# EAGLE design ElectronicThermometerCPO_v7 (EAGLE 9.5.2)
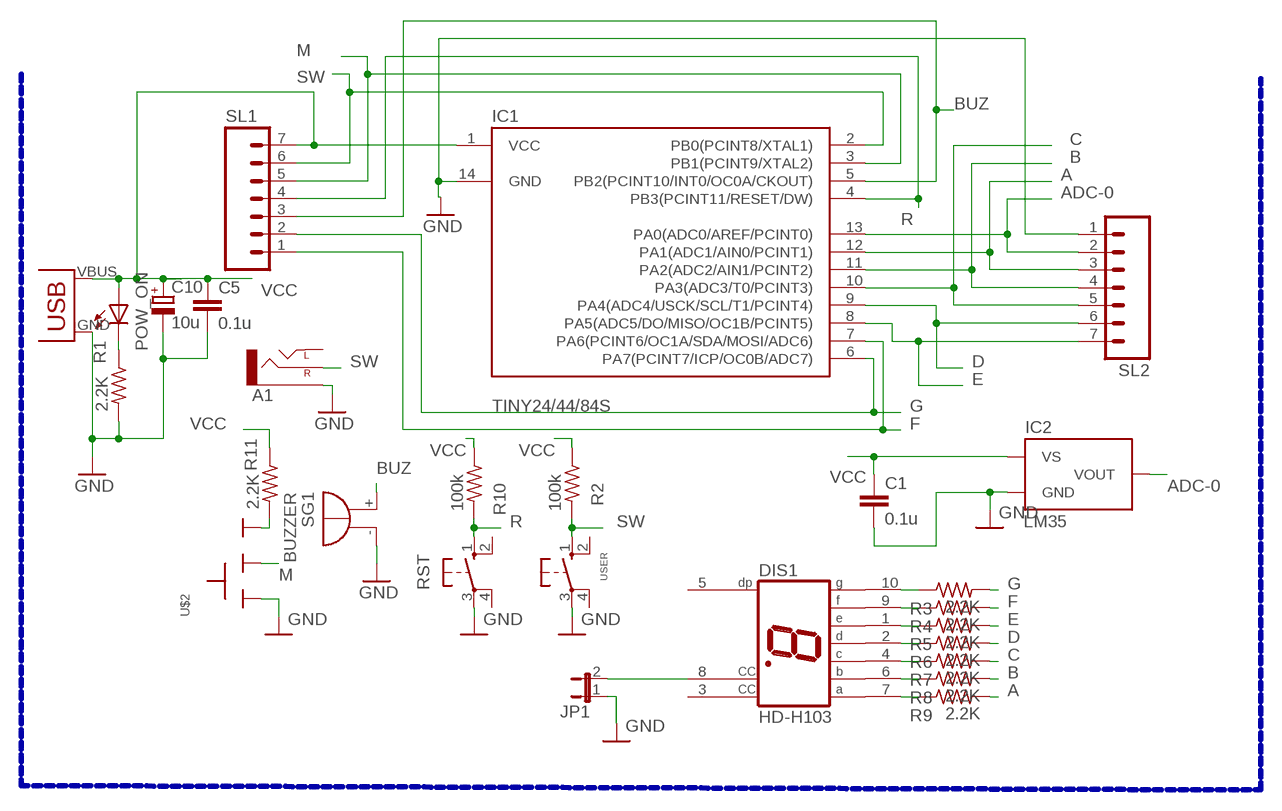
[diagram p0: schematic, sheet 1]

## Parts
A1  AUDIO-JACKPTH  [AUDIO-JACK]
C1  0.1u  C-EUC0805  [C0805]
C5  0.1u  C-EUC0805  [C0805]
C10  10u  CPOL-EUB/3528-21R  [B/3528-21R]
DIS1  HD-H103  [HDSP-M]
IC1  TINY24/44/84S  [SOIC14]
IC2  LM35  [TO92]
JP1  JP1E  [JP1]
POW_ON  LED3MM  [LED3MM]
R1  2.2K  R-US_0207/10  [0207/10]
R2  100k  R-US_0207/10  [0207/10]
R3  2.2K  R-US_0207/10  [0207/10]
R4  2.2K  R-US_0207/10  [0207/10]
R5  2.2K  R-US_0207/10  [0207/10]
R6  2.2K  R-US_0207/10  [0207/10]
R7  2.2K  R-US_0207/10  [0207/10]
R8  2.2K  R-US_0207/10  [0207/10]
R9  2.2K  R-US_0207/10  [0207/10]
R10  100k  R-US_0207/10  [0207/10]
R11  2.2K  R-US_0207/10  [0207/10]
RST  10-XX  [B3F-10XX]
SG1  BUZZER  [F/TMB]
SL1  M07  [07P]
SL2  M07  [07P]
U$1  USB(POWER)  [USB(POWER)]
U$2  SLIDESWITCH-BIG  [BIGSWITCH]
USER  40-XX  [B3F-40XX]

## Nets
A: IC1.12(PA1(ADC1/AIN0/PCINT1)) R9.2 SL2.3
ADC-0: IC1.13(PA0(ADC0/AREF/PCINT0)) IC2.VOUT SL2.2
B: IC1.11(PA2(ADC2/AIN1/PCINT2)) R8.2 SL2.4
BUZ: IC1.5(PB2(PCINT10/INT0/OC0A/CKOUT)) SG1.+ SL1.3
C: IC1.10(PA3(ADC3/T0/PCINT3)) R7.2 SL2.5
D: IC1.9(PA4(ADC4/USCK/SCL/T1/PCINT4)) R6.2 SL2.6
E: IC1.8(PA5(ADC5/DO/MISO/OC1B/PCINT5)) R5.2 SL2.7
F: IC1.7(PA6(PCINT6/OC1A/SDA/MOSI/ADC6)) R4.2 SL1.1
G: IC1.6(PA7(PCINT7/ICP/OC0B/ADC7)) R3.2 SL1.2
GND: A1.SLEEVE C1.2 C5.2 C10.- IC1.14(GND) IC2.GND JP1.1 R1.2 RST.3(P) SG1.- SL2.1 U$1.GND U$2.1 USER.3(P)
M: IC1.3(PB1(PCINT9/XTAL2)) SL1.5 U$2.2
N$1: POW_ON.K(C) R1.1
N$2: DIS1.8(CC) JP1.2
N$6: DIS1.10(G) R3.1
N$7: DIS1.9(F) R4.1
N$9: R11.2 U$2.3
N$10: DIS1.1(E) R5.1
N$11: DIS1.2(D) R6.1
N$12: DIS1.4(C) R7.1
N$13: DIS1.6(B) R8.1
N$20: DIS1.7(A) R9.1
R: IC1.4(PB3(PCINT11/RESET/DW)) R10.2 RST.1(S) SL1.4
SW: A1.RING(RIGHT) IC1.2(PB0(PCINT8/XTAL1)) R2.2 SL1.6 USER.1(S)
VCC: C1.1 C5.1 C10.+ IC1.1(VCC) IC2.VS POW_ON.A R2.1 R10.1 R11.1 SL1.7 U$1.VBUS(VCC)
Unconnected: A1.TIP(LEFT) DIS1.3(CC) DIS1.5(DP) RST.2(S1) RST.4(P1) USER.2(S1) USER.4(P1)

## Buses
B$1

## Library data of the parts
A1 = CEDT_JANUARY_2015_v5:AUDIO-JACK: 3.5mm Audio Jack Simple 3.5mm common PCB mount audio jack. SKU: PRT-08032
C1 C5 = rcl:C-EU: CAPACITOR, European symbol
C10 = rcl:CPOL-EU: POLARIZED CAPACITOR, European symbol
DIS1 = display-hp:HD-H103: LED DISPLAY 1-character 7 segment, decimal point right; OC_FARNELL: unknown; OC_NEWARK: unknown
IC1 = CEDT_JANUARY_2015_v5:TINY24/44/84S
IC2 = CEDT_JANUARY_2015_v5:LM35
JP1 = jumper:JP1E: JUMPER
POW_ON = CEDT_SEPTEMBER_V2:LED
R1-R11 = rcl:R-US_: RESISTOR, American symbol
RST = switch-omron:10-XX: OMRON SWITCH; MPN: B3F-1000; OC_FARNELL: 176432; OC_NEWARK: 36M3542
SG1 = CEDT_JANUARY_2015_v5:BUZZER: BUZZER Source: Buerklin; OC_FARNELL: unknown; OC_NEWARK: unknown
SL1 SL2 = con-amp-quick:M07: AMP QUICK CONNECTOR; OC_FARNELL: unknown; OC_NEWARK: unknown
U$1 = CEDT_JANUARY_2015_v5:USB(POWER)
U$2 = CEDT_JANUARY_2015_v5:SLIDESWITCH
USER = switch-omron:40-XX: OMRON SWITCH; MF: OMRON COMPONENTS USA; MPN: B3F-4000; OC_FARNELL: 176434; OC_NEWARK: 36K3105

## Board
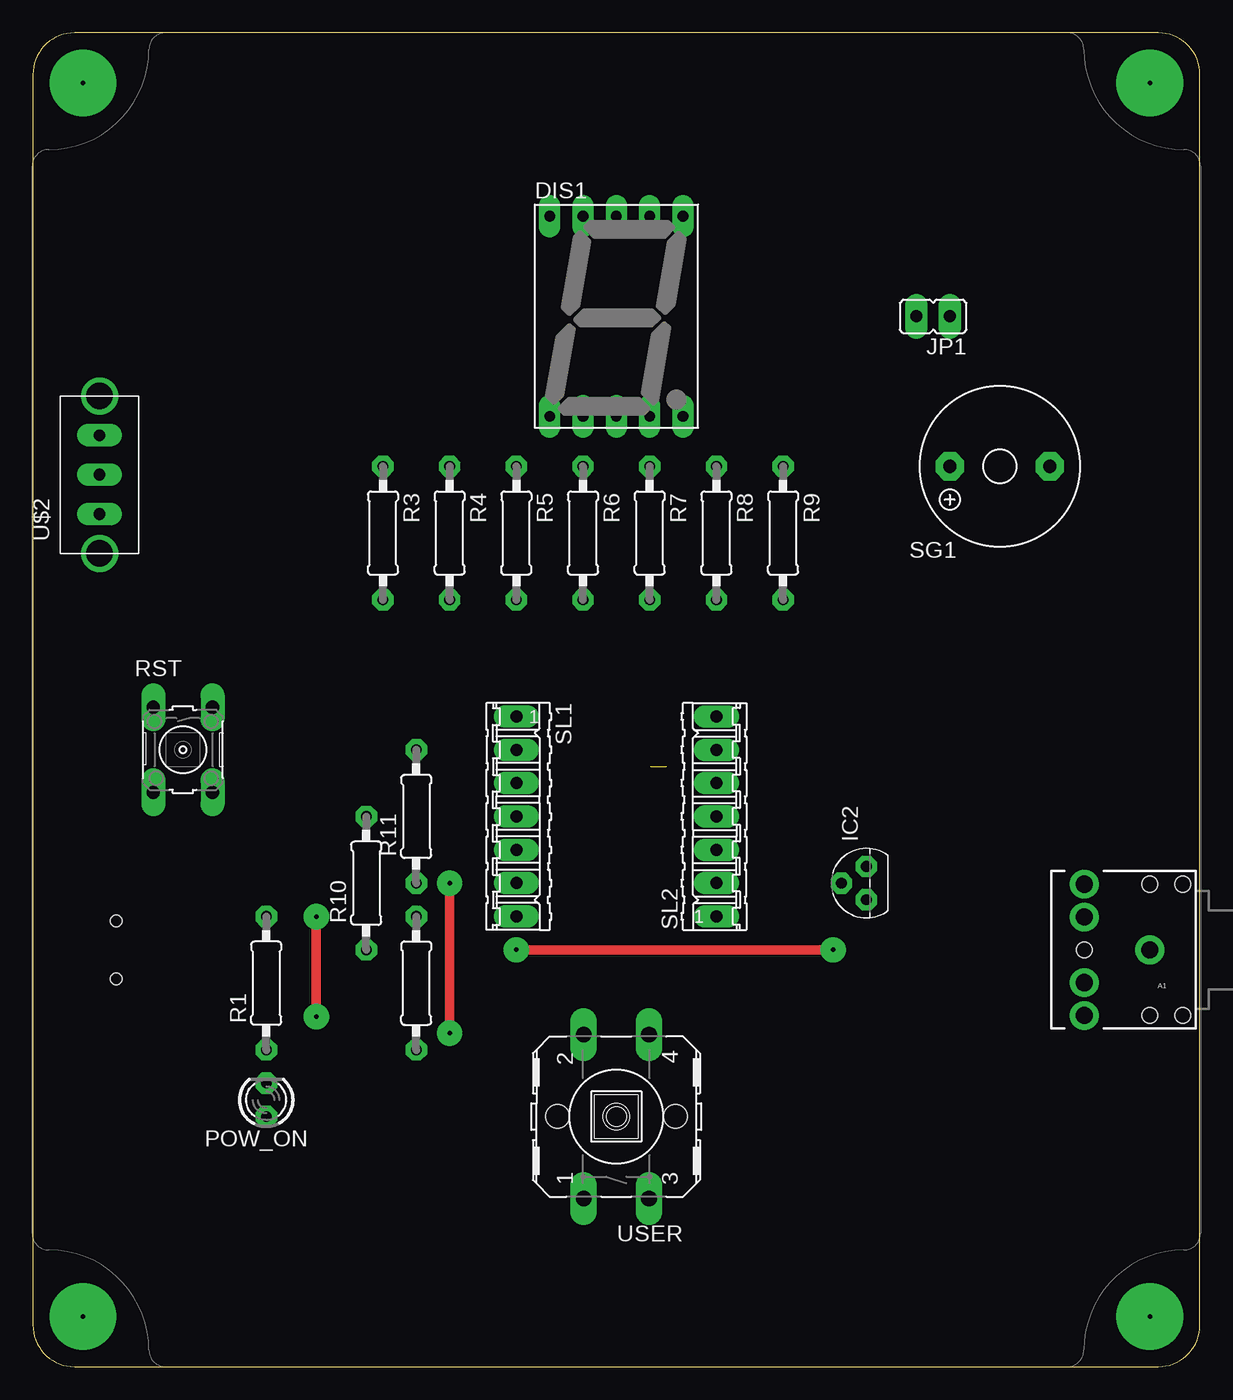
[diagram p1: board, top side]
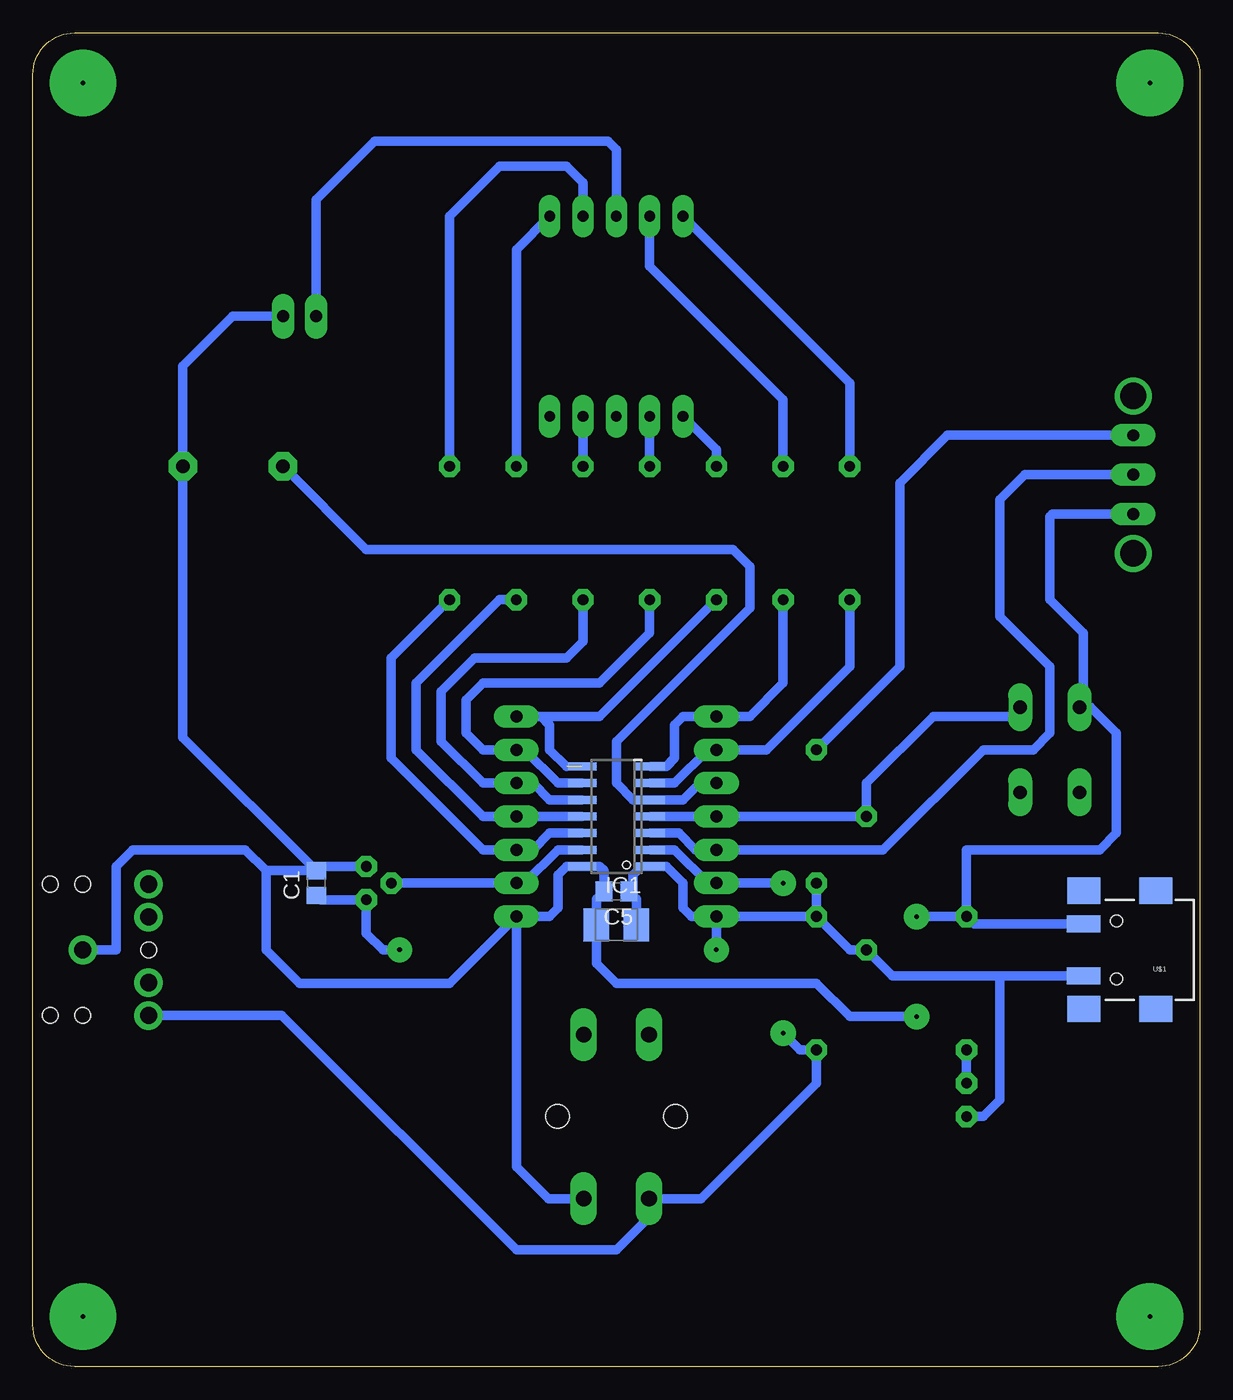
[diagram p2: board, bottom side, seen from below]

Size 88.9 x 101.6 mm. Coordinates in mm from the lower left corner, seen from the top.
Outline: 0,3.17 arc90 3.17,0 85.72,0 arc90 88.9,3.17 88.9,98.42 arc90 85.72,101.6 3.17,101.6 arc90 0,98.42 0,3.17
Copper layers (1*16): Top 0.035mm / dielectric 1.5mm / Bottom 0.035mm
Design rules "default *": minimum track width 28mil, minimum drill 0.35mm, track to track 16mil, track to pad 16mil, pad to pad 16mil, via to via 16mil, smd to smd 6mil, copper to edge 40mil, drill to drill 6mil, minimum pad ring 16mil, minimum via ring 16mil, stop-mask expansion 4mil, vias tented up to drill 0mil, thermal gap 10mil

### Footprints (pad centres in the part's own frame; a part is rotated, then mirrored left to right if it is on the bottom)
AUDIO-JACK = drill 1.3 pad 2.184: RING 5,5; RSH 5,2.5; SLEEVE 0,0; TIP 5,-5; TSH 5,-2.5 | hole 1.2: 0,5; -2.5,5; -2.5,-5; 0,-5; 5,0
C0805 = smd 1.3 x 1.5: 1 -0.95,0; 2 0.95,0
B/3528-21R = smd 1.95 x 2.5: + 1.525,0; - -1.525,0
HDSP-M = drill 0.813 long: 1 -5.08,-7.62; 2 -2.54,-7.62; 3 0,-7.62; 4 2.54,-7.62; 5 5.08,-7.62; 6 5.08,7.62; 7 2.54,7.62; 8 0,7.62; 9 -2.54,7.62; 10 -5.08,7.62
SOIC14 = smd 0.6 x 2.2: 1 -4.445,-2.6; 2 -3.175,-2.6; 3 -1.905,-2.6; 4 -0.635,-2.6; 5 0.635,-2.6; 6 1.905,-2.6; 7 3.175,-2.6; 8 3.175,2.6; 9 1.905,2.6; 10 0.635,2.6; 11 -0.635,2.6; 12 -1.905,2.6; 13 -3.175,2.6; 14 -4.445,2.6
TO92 = drill 0.813 octagon: GND 1.27,0; VOUT 0,1.905; VS -1.27,0
JP1 = drill 0.914 long: 1 0,-1.27; 2 0,1.27
LED3MM = drill 0.813 octagon: A -1.27,0; K 1.27,0
0207/10 = drill 0.813 octagon: 1 -5.08,0; 2 5.08,0
B3F-10XX = drill 1.016 long: 1 -3.251,2.261; 2 3.251,2.261; 3 -3.251,-2.261; 4 3.251,-2.261
F/TMB = drill 1.016 pad 2.159 octagon: + 3.81,0; - -3.81,0
07P = drill 0.914 long: 1 -7.62,0; 2 -5.08,0; 3 -2.54,0; 4 0,0; 5 2.54,0; 6 5.08,0; 7 7.62,0
USB(POWER) = smd 2.54 x 1.27: GND 2.5,-1.981; VBUS 2.5,1.981 | smd 2.5 x 2: GND@1 -3,-4.5; GND@2 -3,4.5; GND@3 2.5,4.5; GND@4 2.5,-4.5 | hole 0.9: 0,2.2; 0,-2.2
BIGSWITCH = drill 0.9 long: 1 -3,0; 2 0,0; 3 3,0 | drill 2 pad 2.184: TAB1 -6,0; TAB2 6,0
B3F-40XX = drill 1.194 long: 1 -6.248,2.489; 2 6.248,2.489; 3 -6.248,-2.489; 4 6.248,-2.489 | hole 1.803: 0,-4.496; 0,4.496

### Placement (x,y rotation side)
A1  85.09,31.75 180 top
C1  67.31,36.83 90 bottom
C5  44.45,36.2 180 bottom
C10  44.45,33.66 0 bottom
DIS1  44.45,80.01 0 top
IC1  44.45,42.55 90 bottom
IC2  63.5,36.83 90 top
JP1  68.58,80.01 90 top
POW_ON  17.78,20.32 90 top
R1  17.78,29.21 90 top
R2  29.21,29.21 270 top
R3  26.67,63.5 270 top
R4  31.75,63.5 270 top
R5  36.83,63.5 270 top
R6  41.91,63.5 270 top
R7  46.99,63.5 270 top
R8  52.07,63.5 270 top
R9  57.15,63.5 270 top
R10  25.4,36.83 90 top
R11  29.21,41.91 90 top
RST  11.43,46.99 270 top
SG1  73.66,68.58 180 top
SL1  36.83,41.91 270 top
SL2  52.07,41.91 90 top
U$1  6.35,31.75 180 bottom
U$2  5.08,67.94 90 top
USER  44.45,19.05 90 top

### Tracks (layer width: path | path; a pad name or v marks a point on that pad's centre or on a via)
A
  Bottom 0.711: IC1.12 49.53,40.64 50.8,39.37 SL2.3 54.61,39.37 61.59,46.35 61.59,53.98 R9.2
ADC-0
  Bottom 0.711: IC1.13 48.9,39.37 51.44,36.83 SL2.2 IC2.VOUT
B
  Bottom 0.711: IC1.11 SL2.4 54.61,41.91 59.69,46.99 59.69,52.07 53.34,58.42 R8.2
BUZ
  Bottom 0.711: SL1.3 38.1,44.45 39.37,43.18 IC1.5 43.18,43.18 44.45,44.45 44.45,47.62 34.29,57.78 34.29,60.96 35.56,62.23 63.5,62.23 SG1.+
C
  Bottom 0.711: IC1.10 49.53,43.18 50.8,44.45 SL2.5 54.61,44.45 57.78,47.62 57.78,51.44 55.24,53.98 48.26,53.98 46.99,55.24 R7.2
D
  Bottom 0.711: IC1.9 48.9,44.45 51.44,46.99 SL2.6 54.61,46.99 55.88,48.26 55.88,50.8 54.61,52.07 45.72,52.07 41.91,55.88 R6.2
E  (1 unrouted)
  Bottom 0.711: 48.26,45.72 49.53,46.99 49.53,48.9 50.16,49.53 SL2.7 45.72,49.53 R5.2
F
  Bottom 0.711: IC1.7 40.64,45.72 40.01,46.35 40.01,48.9 39.37,49.53 SL1.1 34.29,49.53 31.75,52.07 R4.2
G
  Bottom 0.711: IC1.6 40.01,44.45 37.47,46.99 SL1.2 33.02,46.99 26.67,53.34 R3.2
GND  (via drill 0.35 pad 1.93)
  Top 0.711: v21.59,34.29 v21.59,26.67
  Bottom 0.711: SL2.1 49.53,34.29 48.9,34.92 48.9,37.47 48.26,38.1 IC1.14 45.72,38.1 45.4,37.78 C5.2 45.98,35.62 C10.- 45.98,30.73 44.45,29.21 29.21,29.21 26.67,26.67 v21.59,26.67 | USER.3 49.63,12.8 52.07,15.24 SL2.1 | IC2.GND 66.99,38.1 C1.2 | C1.2 71.12,37.78 | U$1.GND 17.22,33.73 R1.2 | R1.2 17.78,39.37 7.62,39.37 6.35,40.64 6.35,48.26 8.33,50.24 RST.3 8.89,50.52 8.89,55.88 11.43,58.42 11.43,64.77 11.26,64.94 U$2.1 | C1.2 77.47,47.94 SG1.- 77.47,76.2 73.66,80.01 JP1.1 | SL2.1 57.15,29.21 68.58,29.21 71.12,31.75 71.12,37.78 | R1.2 v21.59,34.29 | A1.SLEEVE 82.55,31.75 82.55,38.1 81.28,39.37 72.71,39.37 71.12,37.78
M
  Bottom 0.711: IC1.3 39.69,40.64 38.42,39.37 SL1.5 24.13,39.37 16.51,46.99 12.7,46.99 11.43,48.26 11.43,53.34 15.24,57.15 15.24,66.04 13.34,67.94 U$2.2
N$1
  Bottom 0.711: R1.1 POW_ON.K
N$2
  Bottom 0.711: DIS1.8 44.45,92.71 45.09,93.34 62.87,93.34 67.31,88.9 JP1.2
N$3  (via drill 0.35 pad 5.08)
  other vias: 3.81,3.81
N$4  (via drill 0.35 pad 5.08)
  other vias: 85.09,3.81
N$5  (via drill 0.35 pad 5.08)
  other vias: 3.81,97.79
N$6
  Bottom 0.711: R3.1 26.67,74.93 DIS1.10
N$7
  Bottom 0.711: DIS1.9 41.91,83.82 31.75,73.66 R4.1
N$8  (via drill 0.35 pad 5.08)
  other vias: 85.09,97.79
N$9
  Bottom 0.711: R11.2 22.86,53.34 22.86,67.31 19.23,70.94 U$2.3
N$10
  Bottom 0.711: R5.1 36.83,69.85 DIS1.1
N$11
  Bottom 0.711: R6.1 DIS1.2
N$12
  Bottom 0.711: R7.1 DIS1.4
N$13
  Bottom 0.711: DIS1.6 52.07,85.09 R8.1
N$20
  Bottom 0.711: DIS1.7 46.99,90.17 48.26,91.44 53.34,91.44 57.15,87.63 R9.1
R
  Bottom 0.711: IC1.4 SL1.4 R10.2 25.4,44.45 20.32,49.53 14.4,49.53 RST.1
SW  (via drill 0.35 pad 1.93)
  Top 0.711: v31.75,25.4 v31.75,36.83
  Bottom 0.711: IC1.2 40.01,39.37 37.47,36.83 SL1.6 v31.75,36.83 | v31.75,25.4 30.48,24.13 R2.2 29.21,21.59 38,12.8 USER.1 41.96,11.38 44.45,8.89 52.07,8.89 69.93,26.75 A1.RING
VCC  (via drill 0.35 pad 1.93)
  Top 0.711: v60.96,31.75 v36.83,31.75
  Bottom 0.711: SL1.7 38.73,34.29 39.37,34.92 39.37,36.83 40.64,38.1 IC1.1 42.55,38.1 43.18,37.47 43.18,36.52 C5.1 42.92,35.62 C10.+ | SL1.7 R2.1 | C1.1 66.99,35.56 IC2.VS 63.5,33.02 62.23,31.75 v60.96,31.75 | U$1.VBUS 15.24,29.77 | 15.24,29.77 23.42,29.77 R10.1 26.67,31.75 R2.1 | v36.83,31.75 SL1.7 | POW_ON.A 16.51,19.05 15.24,20.32 15.24,29.77 | R2.1 R11.1